# EAGLE schematic PhotoInterruptor (EAGLE 9.2.2)
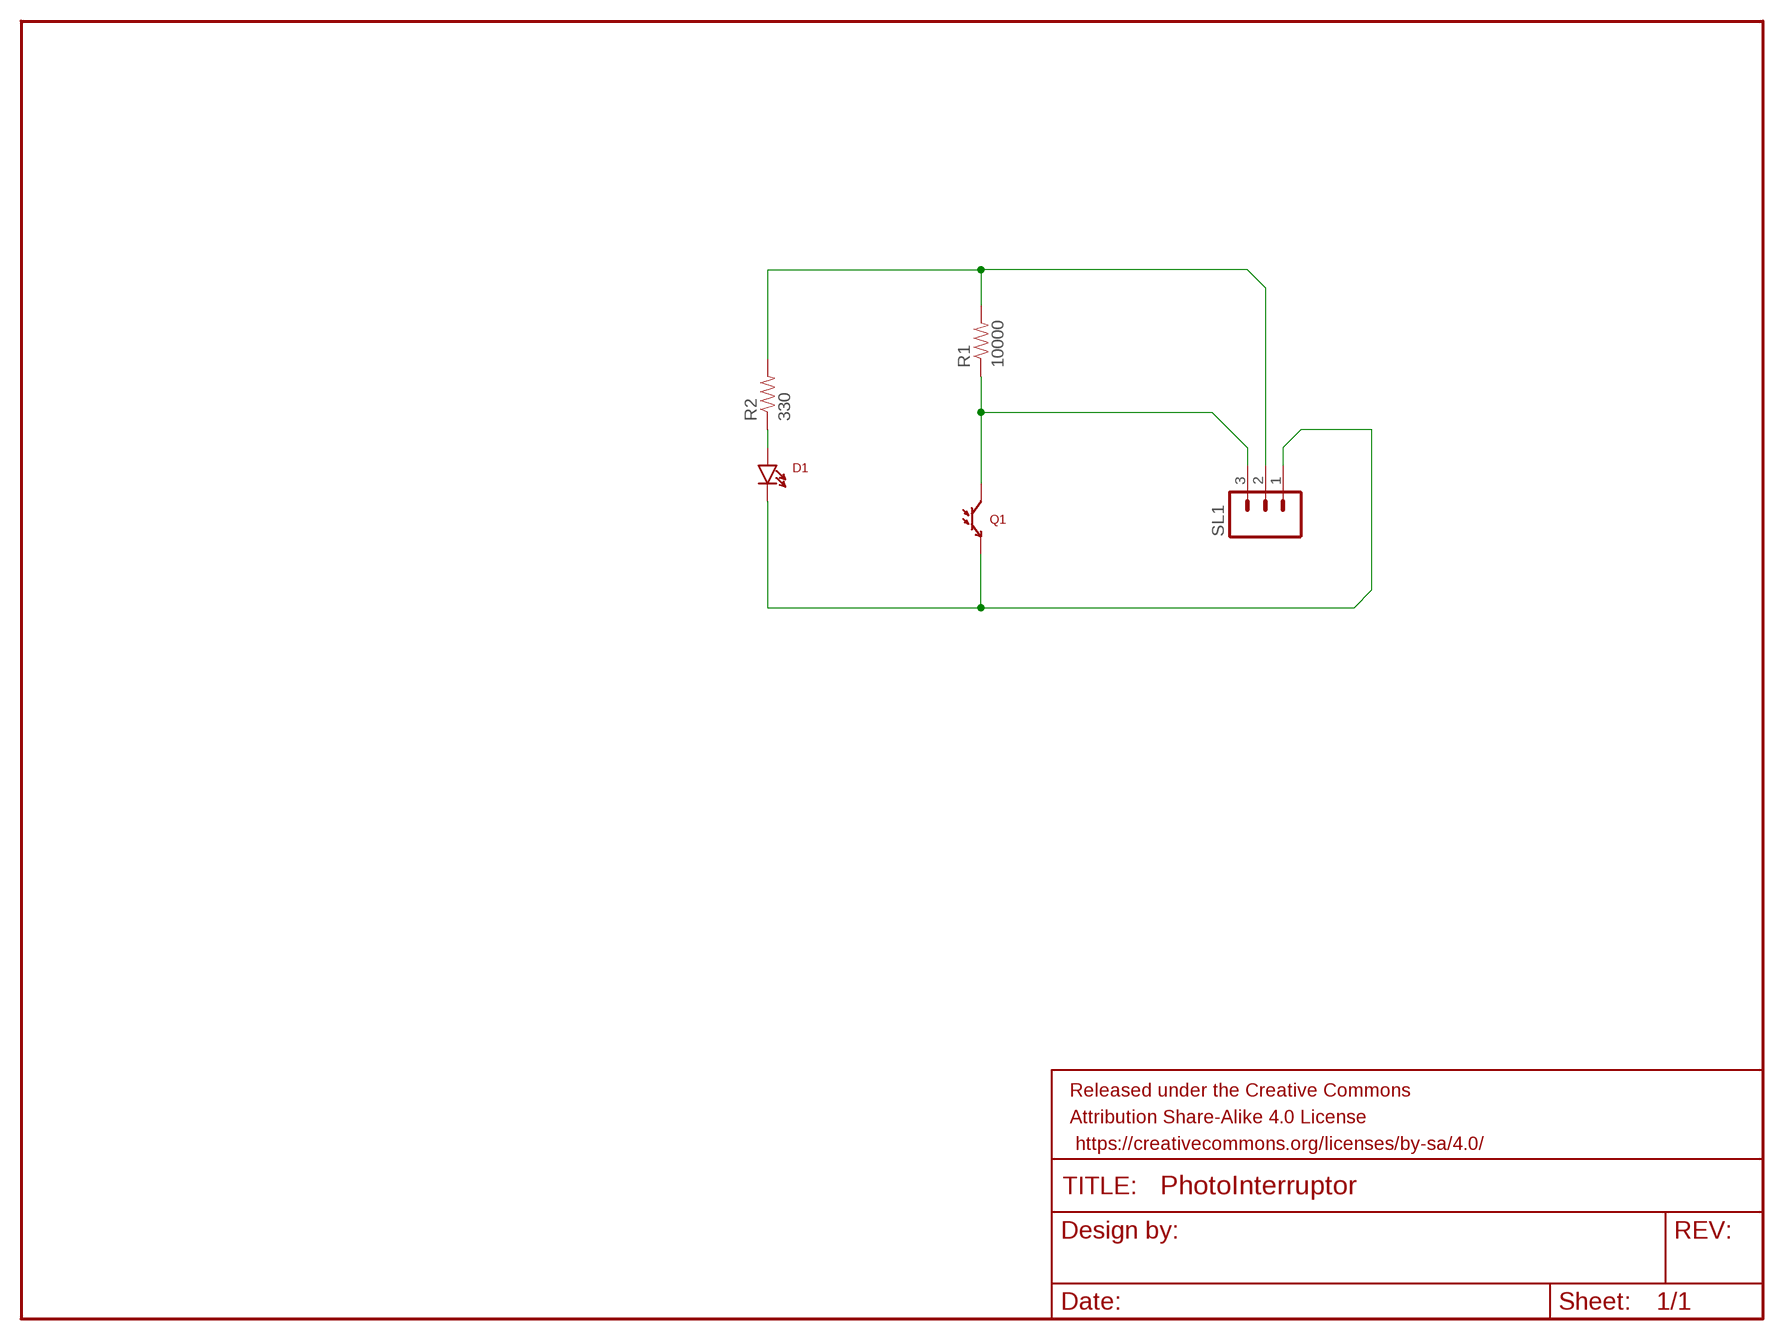
[diagram p0: schematic, sheet 1]

## Parts
D1  LTE-302  [LTE-302]
FRAME1  FRAME-LETTERNO_PACKAGE  [DUMMY]
Q1  LTR-301  [LTR-301]
R1  10000  10KOHM-1/4W-1%(PTH)HORIZ  [AXIAL-0.3]
R2  330  10KOHM-1/4W-1%(PTH)HORIZ  [AXIAL-0.3]
SL1  M03  [03P]

## Nets
N$1: D1.A R2.P$1
N$2: Q1.C R1.P$1 SL1.3
N$3: R1.P$2 R2.P$2 SL1.2
N$4: D1.C Q1.E SL1.1

## Library data of the parts
D1 = SparkFun-LED:LTE-302: Through-hole side-firing 940nm IR LED
FRAME1 = SparkFun-Aesthetics:FRAME-LETTER: Schematic Frame Standard 8.5x11 US Letter frame; DESIGNER: Nobody; VERSION: v01
Q1 = SparkFun-Sensors:LTR-301: Through-hole side-receiving IR phototransistor
R1 R2 = SparkFun-Resistors:10KOHM-1/4W-1%(PTH): RES-12183; PROD_ID: RES-12183; VALUE: 10k
SL1 = con-amp-quick:M03: AMP QUICK CONNECTOR; OC_FARNELL: unknown; OC_NEWARK: unknown